# EAGLE schematic PPMB32-F (EAGLE 9.5.2)

## Sheet 1 of 2
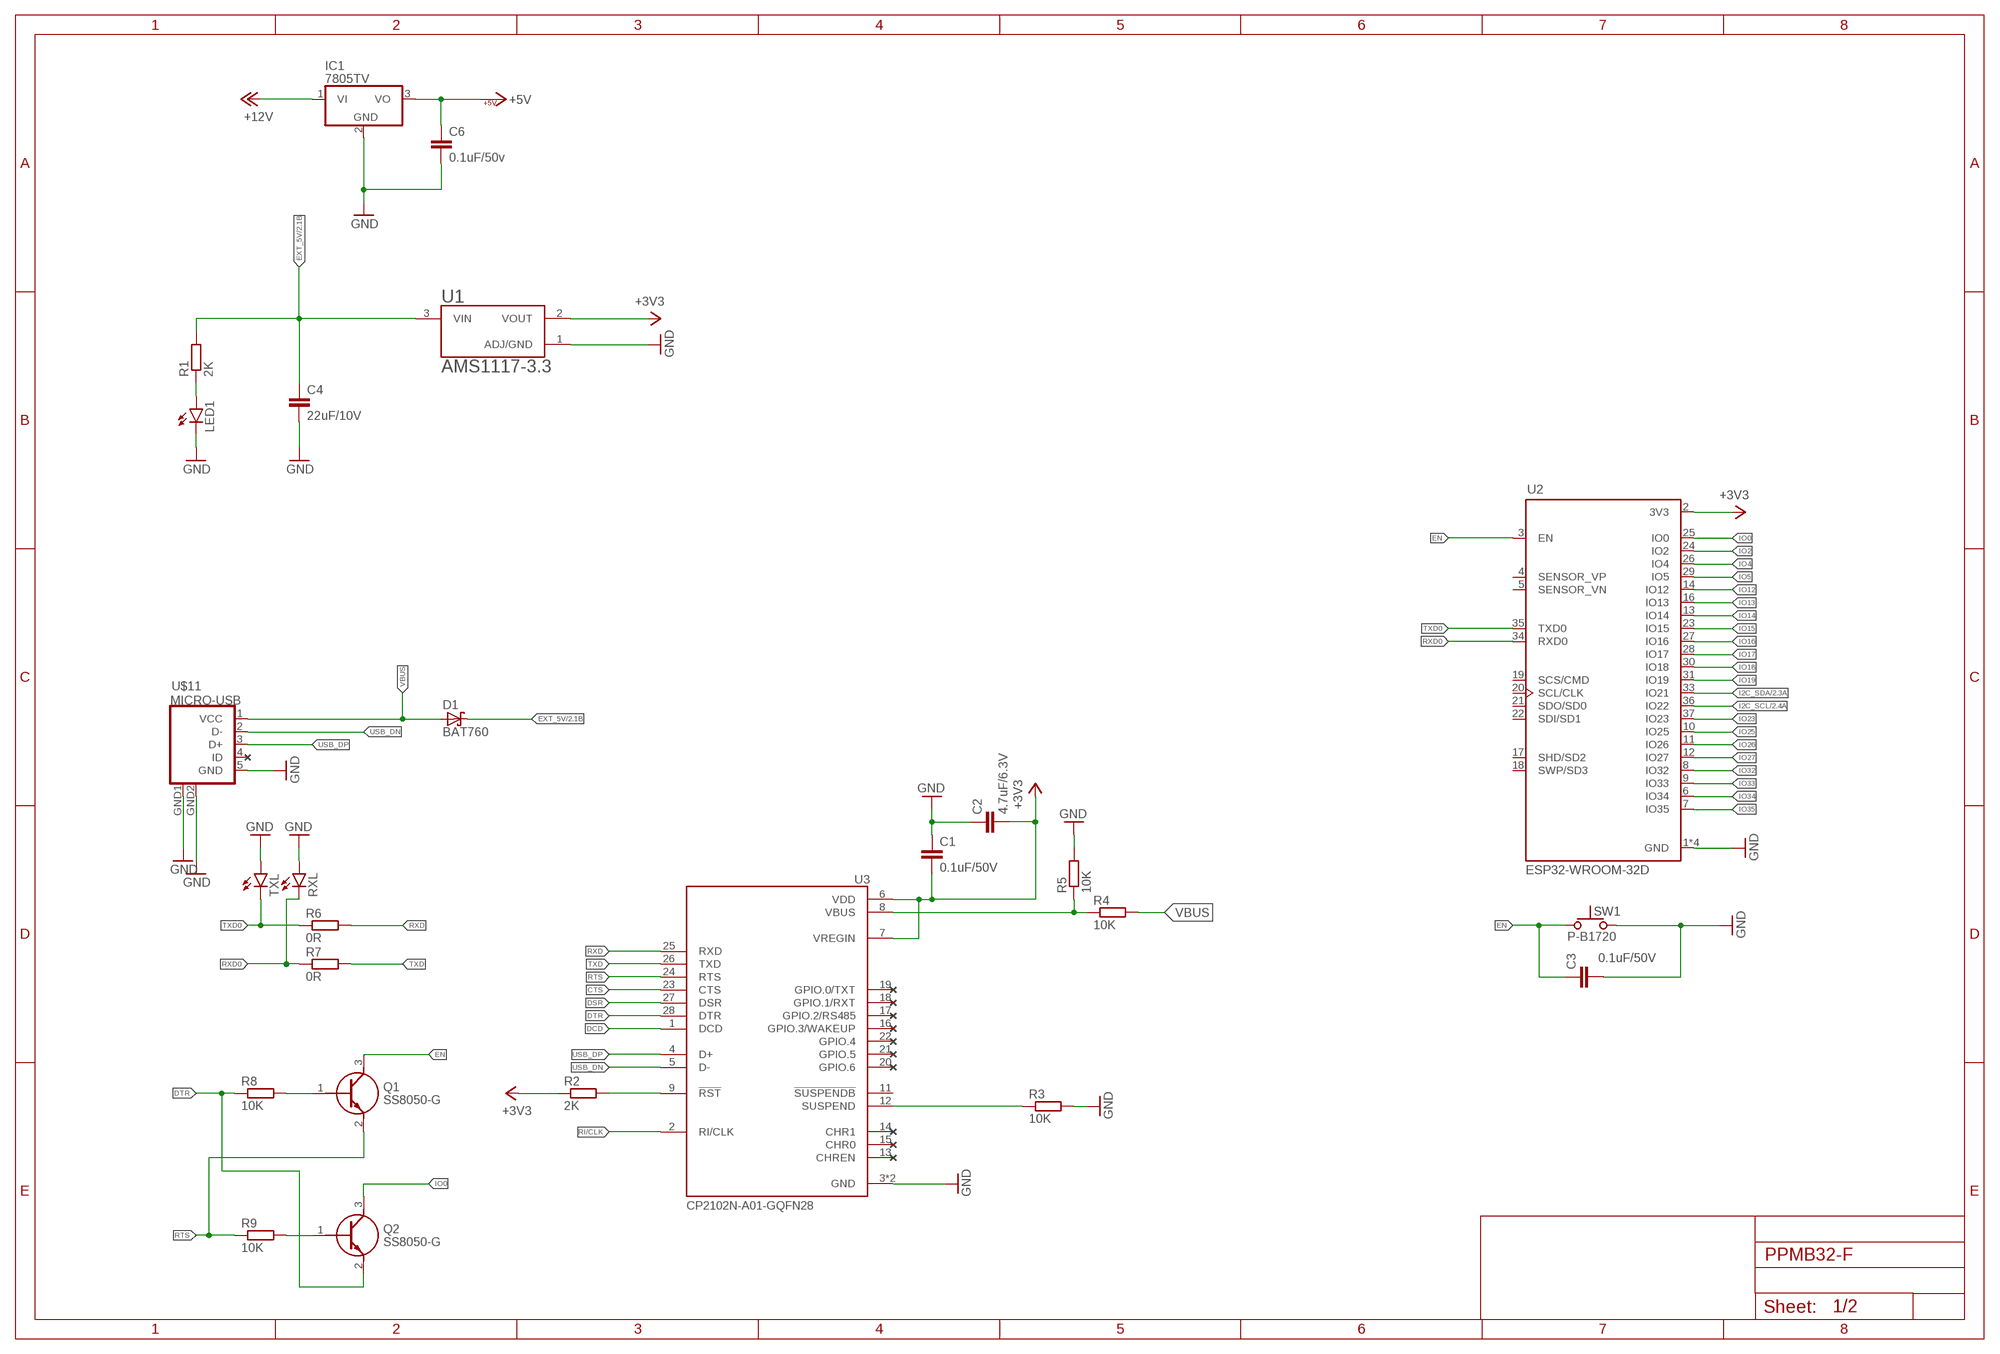
[diagram p0: schematic, sheet 1]

### Parts
C1  0.1uF/50V  C-EUC0603  [C0603]
C2  4.7uF/6.3V  C-EUC0603  [C0603]
C3  0.1uF/50V  C-EUC0603  [C0603]
C4  22uF/10V  C-EUC0603  [C0603]
C6  0.1uF/50v  C-EUC0603  [C0603]
D1  BAT760  [SOD323(F)]
IC1  7805TV  [TO220V]
LED1  LEDCHIP-LED0603  [CHIP-LED0603]
Q1  SS8050-G  [SOT95P240X115-3N]
Q2  SS8050-G  [SOT95P240X115-3N]
R1  2K  R-EU_R0603  [R0603]
R2  2K  R-EU_R0603  [R0603]
R3  10K  R-EU_R0603  [R0603]
R4  10K  R-EU_R0603  [R0603]
R5  10K  R-EU_R0603  [R0603]
R6  0R  R-EU_R0603  [R0603]
R7  0R  R-EU_R0603  [R0603]
R8  10K  R-EU_R0603  [R0603]
R9  10K  R-EU_R0603  [R0603]
RXL  LEDCHIP-LED0603  [CHIP-LED0603]
SW1  P-B1720  [P-B1720]
TXL  LEDCHIP-LED0603  [CHIP-LED0603]
U1  AMS1117-3.3  [SOT229P700X180-4N]
U2  ESP32-WROOM-32D  [MODULE_ESP32-WROOM-32D]
U3  CP2102N-A01-GQFN28  [QFN50P500X500X80-29N]
U$11  MICRO-USB  [MICRO-USB]

### Nets
+3V3: C1.2 C2.2 R2.1 U1.2(VOUT) U2.2(3V3) U3.6(VDD) U3.7(VREGIN)
+5V: C6.1 IC1.3(VO) ; also sheet 2
+12V: IC1.1(VI)
CTS: U3.23(CTS)
DCD: U3.1(DCD)
DSR: U3.27(DSR)
DTR: Q2.2(E) R8.1 U3.28(DTR)
EN: C3.1 Q1.3(C) SW1.1 U2.3(EN)
EXT_5V: C4.1 D1.1(K) R1.2 U1.3(VIN) ; also sheet 2
GND: C1.1 C2.1 C3.2 C4.2 C6.2 IC1.2(GND) LED1.C R3.2 R5.2 RXL.A SW1.2 TXL.A U1.1(ADJ/GND) U2.1(GND) U2.15(GND) U2.38(GND) U2.39(GND) U3.3(GND) U3.29(GND) U$11.5(GND) U$11.GND1(GND) U$11.GND2(GND) ; also sheet 2
I2C_SCL: U2.36(IO22) ; also sheet 2
I2C_SDA: U2.33(IO21) ; also sheet 2
IO0: Q2.3(C) U2.25(IO0)
IO2: U2.24(IO2)
IO4: U2.26(IO4)
IO5: U2.29(IO5)
IO12: U2.14(IO12)
IO13: U2.16(IO13)
IO14: U2.13(IO14)
IO15: U2.23(IO15)
IO16: U2.27(IO16)
IO17: U2.28(IO17)
IO18: U2.30(IO18)
IO19: U2.31(IO19)
IO23: U2.37(IO23)
IO25: U2.10(IO25)
IO26: U2.11(IO26)
IO27: U2.12(IO27)
IO32: U2.8(IO32)
IO33: U2.9(IO33)
IO34: U2.6(IO34)
IO35: U2.7(IO35)
N$1: R2.2 U3.9(!RST)
N$2: Q1.1(B) R8.2
N$6: Q2.1(B) R9.2
N$7: LED1.A R1.1
N$9: R3.1 U3.12(SUSPEND)
N$10: R4.1 R5.1 U3.8(VBUS)
RI/CLK: U3.2(RI/CLK)
RTS: Q1.2(E) R9.1 U3.24(RTS)
RXD: R6.2 U3.25(RXD)
RXD0: R7.1 RXL.C U2.34(RXD0)
TXD: R7.2 U3.26(TXD)
TXD0: R6.1 TXL.C U2.35(TXD0)
USB_DN: U3.5(D-) U$11.2(D-)
USB_DP: U3.4(D+) U$11.3(D+)
VBUS: D1.2(A) R4.2 U$11.1(VCC)
Unconnected: SW1.3 SW1.4 U2.4(SENSOR_VP) U2.5(SENSOR_VN) U2.17(SHD/SD2) U2.18(SWP/SD3) U2.19(SCS/CMD) U2.20(SCL/CLK) U2.21(SDO/SD0) U2.22(SDI/SD1) U3.11(!SUSPENDB) U3.13(CHREN) U3.14(CHR1) U3.15(CHR0) U3.16(GPIO.3/WAKEUP) U3.17(GPIO.2/RS485) U3.18(GPIO.1/RXT) U3.19(GPIO.0/TXT) U3.20(GPIO.6) U3.21(GPIO.5) U3.22(GPIO.4) U$11.4(ID)

## Sheet 2 of 2
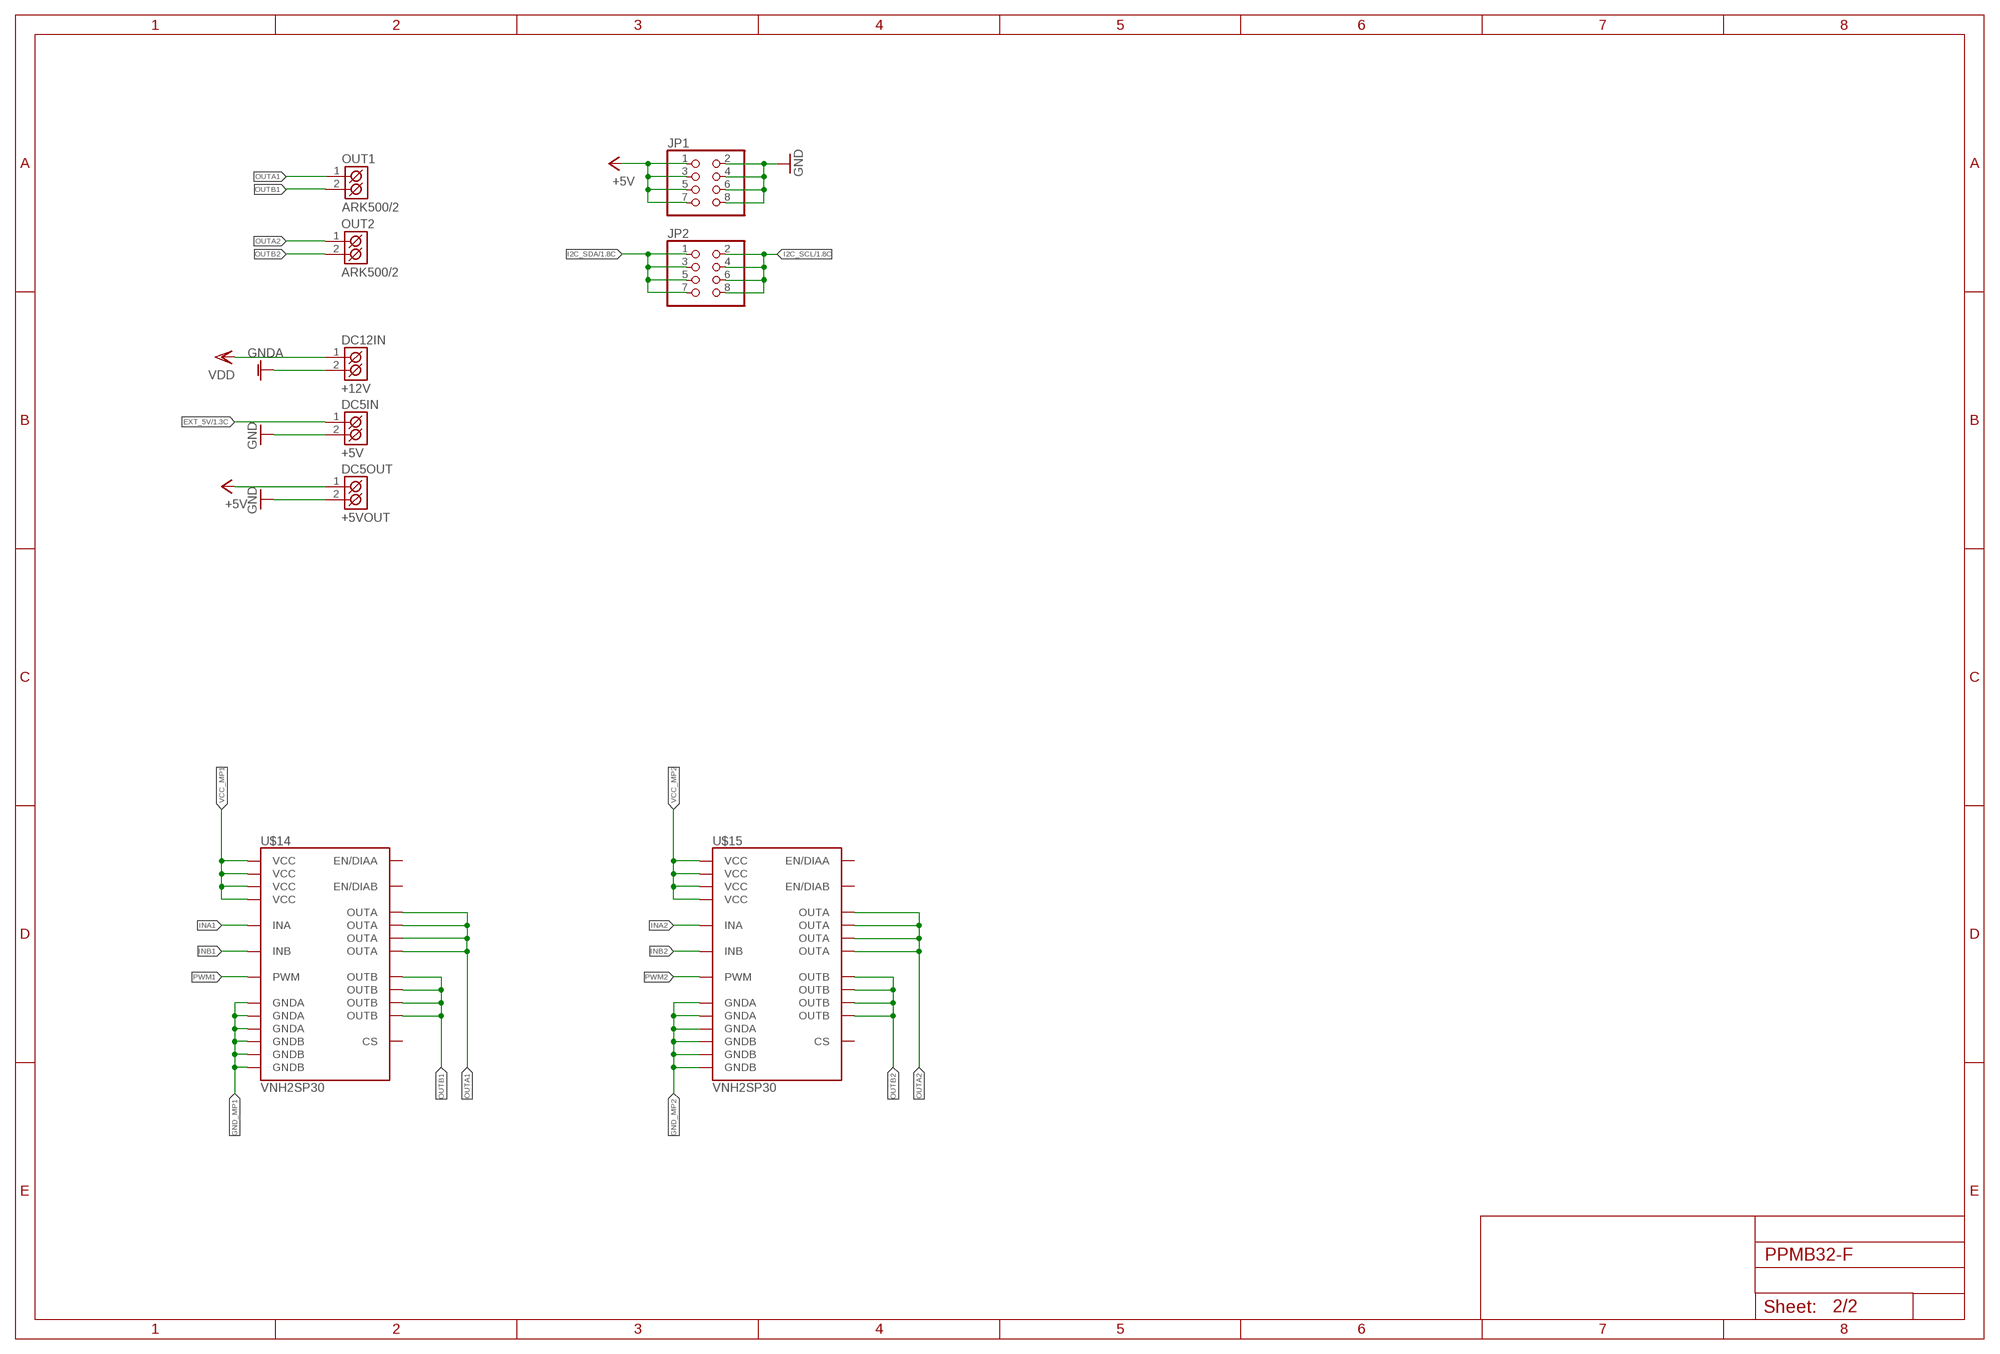
[diagram p1: schematic, sheet 2]

### Parts
DC5IN  +5V  ARK500/2  [ARK500/2]
DC5OUT  +5VOUT  ARK500/2  [ARK500/2]
DC12IN  +12V  ARK500/2  [ARK500/2]
JP1  PINHD-2X4  [2X04]
JP2  PINHD-2X4  [2X04]
OUT1  ARK500/2  [ARK500/2]
OUT2  ARK500/2  [ARK500/2]
U$14  VNH2SP30  [VNH2SP30]
U$15  VNH2SP30  [VNH2SP30]

### Nets
+5V: DC5OUT.1(K1) JP1.1 JP1.3 JP1.5 JP1.7 ; also sheet 1
EXT_5V: DC5IN.1(K1) ; also sheet 1
GND: DC5IN.2(K2) DC5OUT.2(K2) JP1.2 JP1.4 JP1.6 JP1.8 ; also sheet 1
GND_MP1: U$14.18(GNDB) U$14.19(GNDB) U$14.20(GNDB) U$14.26(GNDA) U$14.27(GNDA) U$14.28(GNDA)
GND_MP2: U$15.18(GNDB) U$15.19(GNDB) U$15.20(GNDB) U$15.26(GNDA) U$15.27(GNDA) U$15.28(GNDA)
GNDA: DC12IN.2(K2)
I2C_SCL: JP2.2 JP2.4 JP2.6 JP2.8 ; also sheet 1
I2C_SDA: JP2.1 JP2.3 JP2.5 JP2.7 ; also sheet 1
INA1: U$14.5(INA)
INA2: U$15.5(INA)
INB1: U$14.11(INB)
INB2: U$15.11(INB)
OUTA1: OUT1.1(K1) U$14.1(OUTA) U$14.25(OUTA) U$14.30(OUTA) U$14.SLUG3(OUTA)
OUTA2: OUT2.1(K1) U$15.1(OUTA) U$15.25(OUTA) U$15.30(OUTA) U$15.SLUG3(OUTA)
OUTB1: OUT1.2(K2) U$14.15(OUTB) U$14.16(OUTB) U$14.21(OUTB) U$14.SLUG2(OUTB)
OUTB2: OUT2.2(K2) U$15.15(OUTB) U$15.16(OUTB) U$15.21(OUTB) U$15.SLUG2(OUTB)
PWM1: U$14.8(PWM)
PWM2: U$15.8(PWM)
VCC_MP1: U$14.3(VCC) U$14.13(VCC) U$14.23(VCC) U$14.SLUG1(VCC)
VCC_MP2: U$15.3(VCC) U$15.13(VCC) U$15.23(VCC) U$15.SLUG1(VCC)
VDD: DC12IN.1(K1)
Unconnected: U$14.6(EN/DIAA) U$14.9(CS) U$14.10(EN/DIAB) U$15.6(EN/DIAA) U$15.9(CS) U$15.10(EN/DIAB)

## Library data of the parts
C1-C4 C6 = rcl:C-EU: CAPACITOR, European symbol; SPICEPREFIX: C
D1 = nxp_60_1_1:BAT760: Medium power Schottky barrier single diode Planar medium power Schottky barrier single diode with an integrated guard ring for stress protection, encapsulated in a SOD323 (SC-76) very small Surface-Mounted Device SMD plastic package. AAL Eindhoven MK
DC5IN DC5OUT DC12IN OUT1 OUT2 = #PaJa_konektory:ARK500/2: Svorkovnice - roztec 5mm - dvojita
IC1 = linear:78*: Positive VOLTAGE REGULATOR Source: http://cache.national.com/ds/LM/LM78L05.pdf http://www.fairchildsemi.com/ds/LM/LM7805.pdf
JP1 JP2 = pinhead:PINHD-2X4: PIN HEADER
LED1 RXL TXL = led:LED: LED OSRAM: - CHIPLED LG R971, LG N971, LY N971, LG Q971, LY Q971, LO R971, LY R971 LH N974, LH R974 LS Q976, LO Q976, LY Q976 LO Q996 - Hyper CHIPLED LW Q18S LB Q993, LB Q99A, LB R99A - SideLED LS A670, LO A670, LY A670, LG A670, LP A670 LB A673, LV A673, LT A673, LW A673 LH A674 LY A675 LS A676, LA A676, LO A676, LY A676, LW A676 LS A679, LY A679, LG A679 - Hyper Micro SIDELED® LS Y876, LA Y876, LO Y876, LY Y876 LT Y87S - SmartLED LW L88C, LW L88S LB L89C, LB L89S, LG L890 LS L89K, LO L89K, LY L89K LS L896, LA L896, LO L896, LY L896 - TOPLED LS T670, LO T670, LY T670, LG T670, LP T670 LSG T670, LSP T670, LSY T670, LOP T670, LYG T670 LG T671, LOG T671, LSG T671 LB T673, LV T673, LT T673, LW T673 LH T674 LS T676, LA T676, LO T676, LY T676, LB T676, LH T676, LSB T676, LW T676 LB T67C, LV T67C, LT T67C, LS T67K, LO T67K, LY T67K, LW E67C LS E67B, LA E67B, LO E67B, LY E67B, LB E67C, LV E67C, LT E67C LW T67C LS T679, LY T679, LG T679 LS T770, LO T770, LY T770, LG T770, LP T770 LB T773, LV T773, LT T773, LW T773 LH T774 LS E675, LA E675, LY E675, LS T675 LS T776, LA T776, LO T776, LY T776, LB T776 LHGB T686 LT T68C, LB T68C - Hyper Mini TOPLED® LB M676 - Mini TOPLED Santana® LG M470 LS M47K, LO M47K, LY M47K Source: http://www.osram.convergy.de LUXEON: - LUMILED® LXK2-PW12-R00, LXK2-PW12-S00, LXK2-PW14-U00, LXK2-PW14-V00 LXK2-PM12-R00, LXK2-PM12-S00, LXK2-PM14-U00 LXK2-PE12-Q00, LXK2-PE12-R00, LXK2-PE12-S00, LXK2-PE14-T00, LXK2-PE14-U00 LXK2-PB12-K00, LXK2-PB12-L00, LXK2-PB12-M00, LXK2-PB14-N00, LXK2-PB14-P00, LXK2-PB14-Q00 LXK2-PR12-L00, LXK2-PR12-M00, LXK2-PR14-Q00, LXK2-PR14-R00 LXK2-PD12-Q00, LXK2-PD12-R00, LXK2-PD12-S00 LXK2-PH12-R00, LXK2-PH12-S00 LXK2-PL12-P00, LXK2-PL12-Q00, LXK2-PL12-R00 Source: www.luxeon.com KINGBRIGHT: KA-3528ASYC Source: www.kingbright.com
Q1 Q2 = SS8050-G:SS8050-G: Bipolar Transistors - BJT NPN TRANSISTOR 1.5A 40V Source: Datasheet <http://www.comchiptech.com/admin/files/product/SS8050-G RevA181526.pdf>; AVAILABILITY: Unavailable; DESCRIPTION: Bipolar _BJT_ Transistor NPN 25V 1.5A 100MHz 300mW Surface Mount SOT-23; MF: Comchip Technology; MP: SS8050-G; PACKAGE: TO-236 Comchip; PRICE: None
R1-R9 = rcl:R-EU_: RESISTOR, European symbol; SPICEPREFIX: R
SW1 = #PaJa_prepinace:P-B1720: µ-tlacitko
U1 = AMS1117-3.3:AMS1117-3.3: Sot223/Pkg 1-Amp 3.3-Volt Low Drop Out Voltage Regulatator; AVAILABILITY: Unavailable; DESCRIPTION: Sot-89; MF: Advanced Monolithic Systems; MP: AMS1117-3.3; PACKAGE: SOT-89 ams; PRICE: None
U2 = ESP32-WROOM-32D:ESP32-WROOM-32D: IC: SoC; GPIO, I2C, I2S, IR, SD, SDIO, SPI, UART; 2.7÷3.6VDC; 20dBm; AVAILABILITY: Unavailable; DESCRIPTION: Bluetooth, WiFi 802.11b/g/n, Bluetooth v4.2 + EDR, Class 1, 2 and 3 Transceiver Module 2.4GHz ~ 2.5GHz Integrated, Trace Surface Mount; MF: Espressif Systems; MP: ESP32-WROOM-32D; PACKAGE: Module Espressif Systems; PRICE: None
U3 = CP2102N-A01-GQFN28:CP2102N-A01-GQFN28: Ic Bridge Usb To Uart 28qfn; AVAILABILITY: Unavailable; DESCRIPTION: USB Bridge, USB to UART USB 2.0 UART Interface 28-QFN _5x5_; MF: Silicon Labs; MP: CP2102N-A01-GQFN28; PACKAGE: QFN-28 Silicon Labs; PRICE: None
U$11 = microusb:MICRO-USB: Micro USB B connector
U$14 U$15 = SparkFun-IC-Special-Function:VNH2SP30: 30A motor driver IC(IC-10030,moster moto)